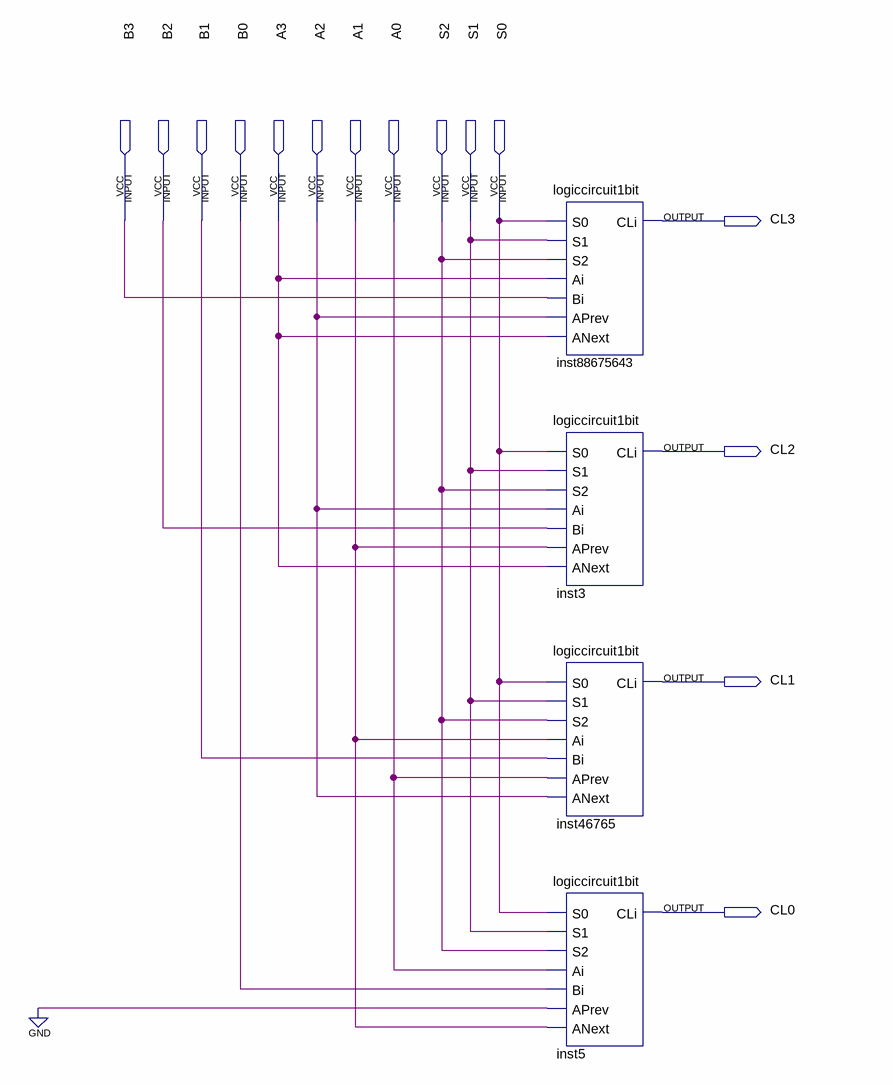
[diagram p0: schematic sheet]
// Quartus schematic 4bitLSC.bdf as structural Verilog: 4 symbols, 15 pins
module \4bitLSC  (
  input  B3,
  input  B2,
  input  B1,
  input  B0,
  input  A3,
  input  A2,
  input  A1,
  input  A0,
  input  S2,
  input  S1,
  input  S0,
  output CL3,
  output CL2,
  output CL1,
  output CL0
);

  logiccircuit1bit inst88675643 (.S0(S0), .S1(S1), .S2(S2), .Ai(A3), .Bi(B3), .APrev(A2), .ANext(A3), .CLi(CL3));
  logiccircuit1bit inst3 (.S0(S0), .S1(S1), .S2(S2), .Ai(A2), .Bi(B2), .APrev(A1), .ANext(A3), .CLi(CL2));
  logiccircuit1bit inst46765 (.S0(S0), .S1(S1), .S2(S2), .Ai(A1), .Bi(B1), .APrev(A0), .ANext(A2), .CLi(CL1));
  logiccircuit1bit inst5 (.S0(S0), .S1(S1), .S2(S2), .Ai(A0), .Bi(B0), .APrev(1'b0), .ANext(A1), .CLi(CL0));
endmodule
